# EAGLE design Grove - Haptic Motor v0.9 (EAGLE 7.1.0)
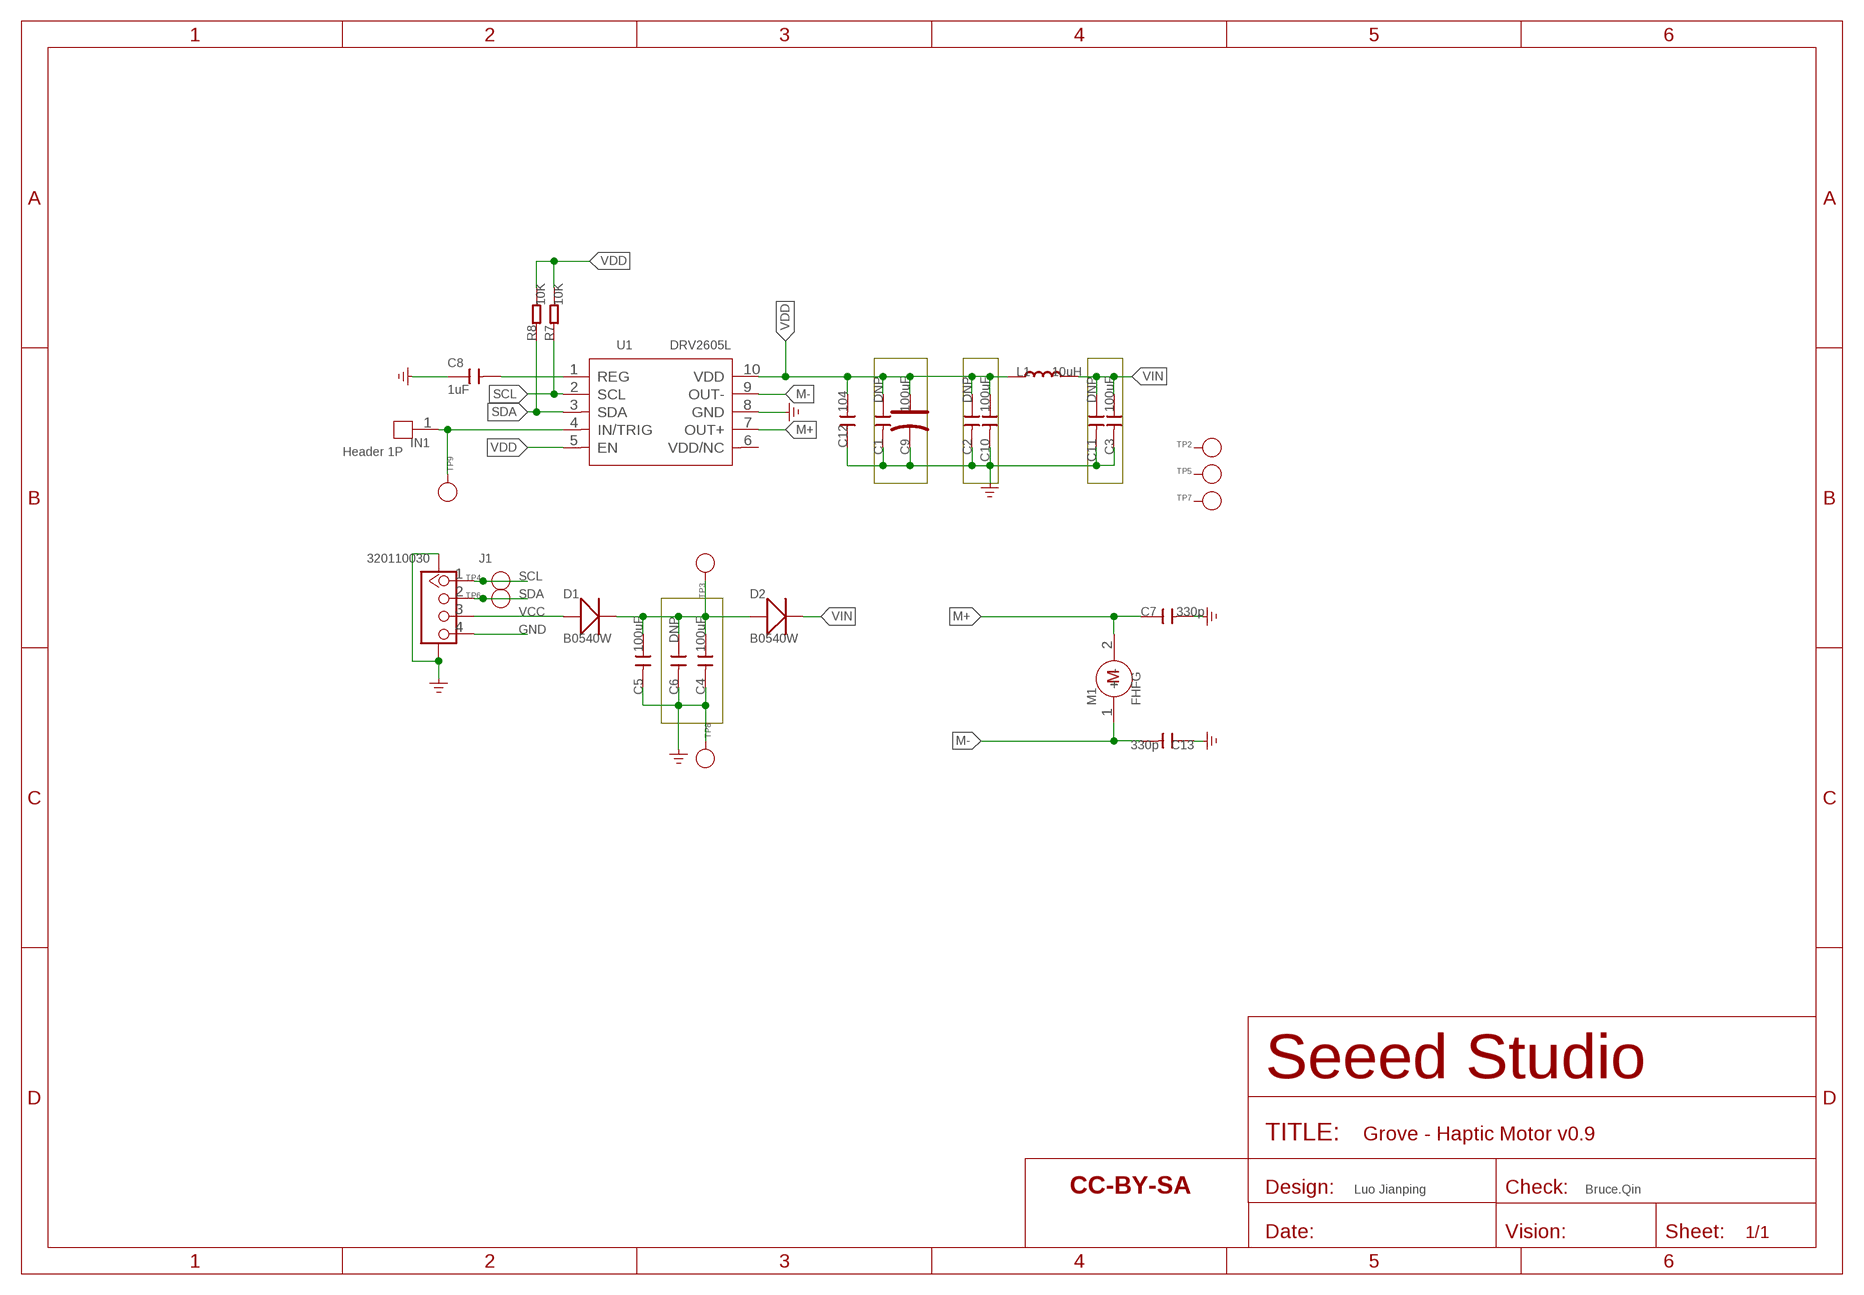
[diagram p0: schematic, sheet 1]

## Parts
C1  DNP  CAP-0805  [C0805]
C2  DNP  CAP-0805  [C0805]
C3  100uF  CAP-1206  [C1206]
C4  100uF  CAP-1206  [C1206]
C5  100uF  CAP-0603  [C0603]
C6  DNP  CAP-0805  [C0805]
C7  330p  CAP-0603  [C0603]
C8  1uF  CAP-0603  [C0603]
C9  100uF  CAP-POLAR-AVX-B  [AVX-B]
C10  100uF  CAP-1206  [C1206]
C11  DNP  CAP-0805  [C0805]
C12  104  CAP-0603  [C0603]
C13  330p  CAP-0603  [C0603]
D1  B0540W  DIODE'1206'  [SOD-123]
D2  B0540W  DIODE'1206'  [SOD-123]
IN1  Header 1P  HEADER-1P-35  [1P-65/35MIL]
J1  320110030  GROVE-CONNECTOR-SMD'DD'  [HW4-SMD-2.0]
L1  10uH  INDUCTOR/FERRITE-BEAD'0806'  [L0806]
M1  FHFG  MOTOR-EXT_MOUDLE_1CM  [MTR2-SMD-D11.2MM]
R7  10K  RES-0603  [R0603]
R8  10K  RES-0603  [R0603]
TP2  PAD-TEST-POINT'4545'  [TP_4545]
TP3  PAD-TEST-POINT'4545'  [TP_4545]
TP4  PAD-TEST-POINT'4545'  [TP_4545]
TP5  PAD-TEST-POINT'4545'  [TP_4545]
TP6  PAD-TEST-POINT'4545'  [TP_4545]
TP7  PAD-TEST-POINT'4545'  [TP_4545]
TP8  PAD-TEST-POINT'4545'  [TP_4545]
TP9  PAD-TEST-POINT'4545'  [TP_4545]
U1  DRV2605L  SENSOR-DRV2605L  [VSSOP10-0.5-3X3MM]
U$9  SEEEDSTUDIO-OPEN-SCH-FRAME  [SEEEDSTUDIO-PCB-FRAME]

## Nets
GND: C1.2 C2.2 C3.2 C4.2 C5.2 C6.2 C7.2 C8.1 C9.- C10.2 C11.2 C12.1 C13.1 J1.4 J1.SS1 J1.SS2 TP8.T U1.8(GND) ; supply symbol labelled GND_POWER
IN/TRIG2: IN1.1 TP9.T U1.4(IN/TRIG)
M+: C7.1 M1.2(-) U1.7(OUT+)
M-: C13.2 M1.1(+) U1.9(OUT-)
REG: C8.2 U1.1(REG)
SCL: J1.1 R7.1 TP4.T U1.2(SCL)
SDA: J1.2 R8.1 TP6.T U1.3(SDA)
VCC: D1.+ J1.3
VDD: C1.1 C2.1 C9.+ C10.1 C12.2 L1.1 R7.2 R8.2 U1.5(EN) U1.10(VDD)
VIN: C3.1 C11.1 D2.- L1.2
VIN-1: C4.1 C5.1 C6.1 D1.- D2.+ TP3.T
Unconnected: TP2.T TP5.T TP7.T U1.6(VDD/NC)

## Notes on the sheet
- Luo Jianping | Bruce.Qin

## Library data of the parts
C1-C8 C10-C13 = Discrete-new:CAP: Ceramic Capacitors
C9 = Discrete-new:CAP-POLAR: Electrolytic Capacitors,Tantalum Capacitors and Super Capacitors
D1 D2 = Discrete-new:DIODE*
IN1 = Connector-new:HEADER-1P
J1 = Connector-new:GROVE-CONNECTOR-SMD: 4P-SMD-2.0:320110030;4P-SMD-2.0-90D:320110032
L1 = Discrete-new:INDUCTOR/FERRITE-BEAD
M1 = Discrete-new:MOTOR-EXT_MOUDLE_1CM
R7 R8 = Discrete-new:RES
TP2-TP9 = Discrete:PAD-TEST-POINT; PARTNO: DNP
U1 = template:SENSOR-DRV2605L
U$9 = moudle-new:SEEEDSTUDIO-OPEN-SCH-FRAME

## Board
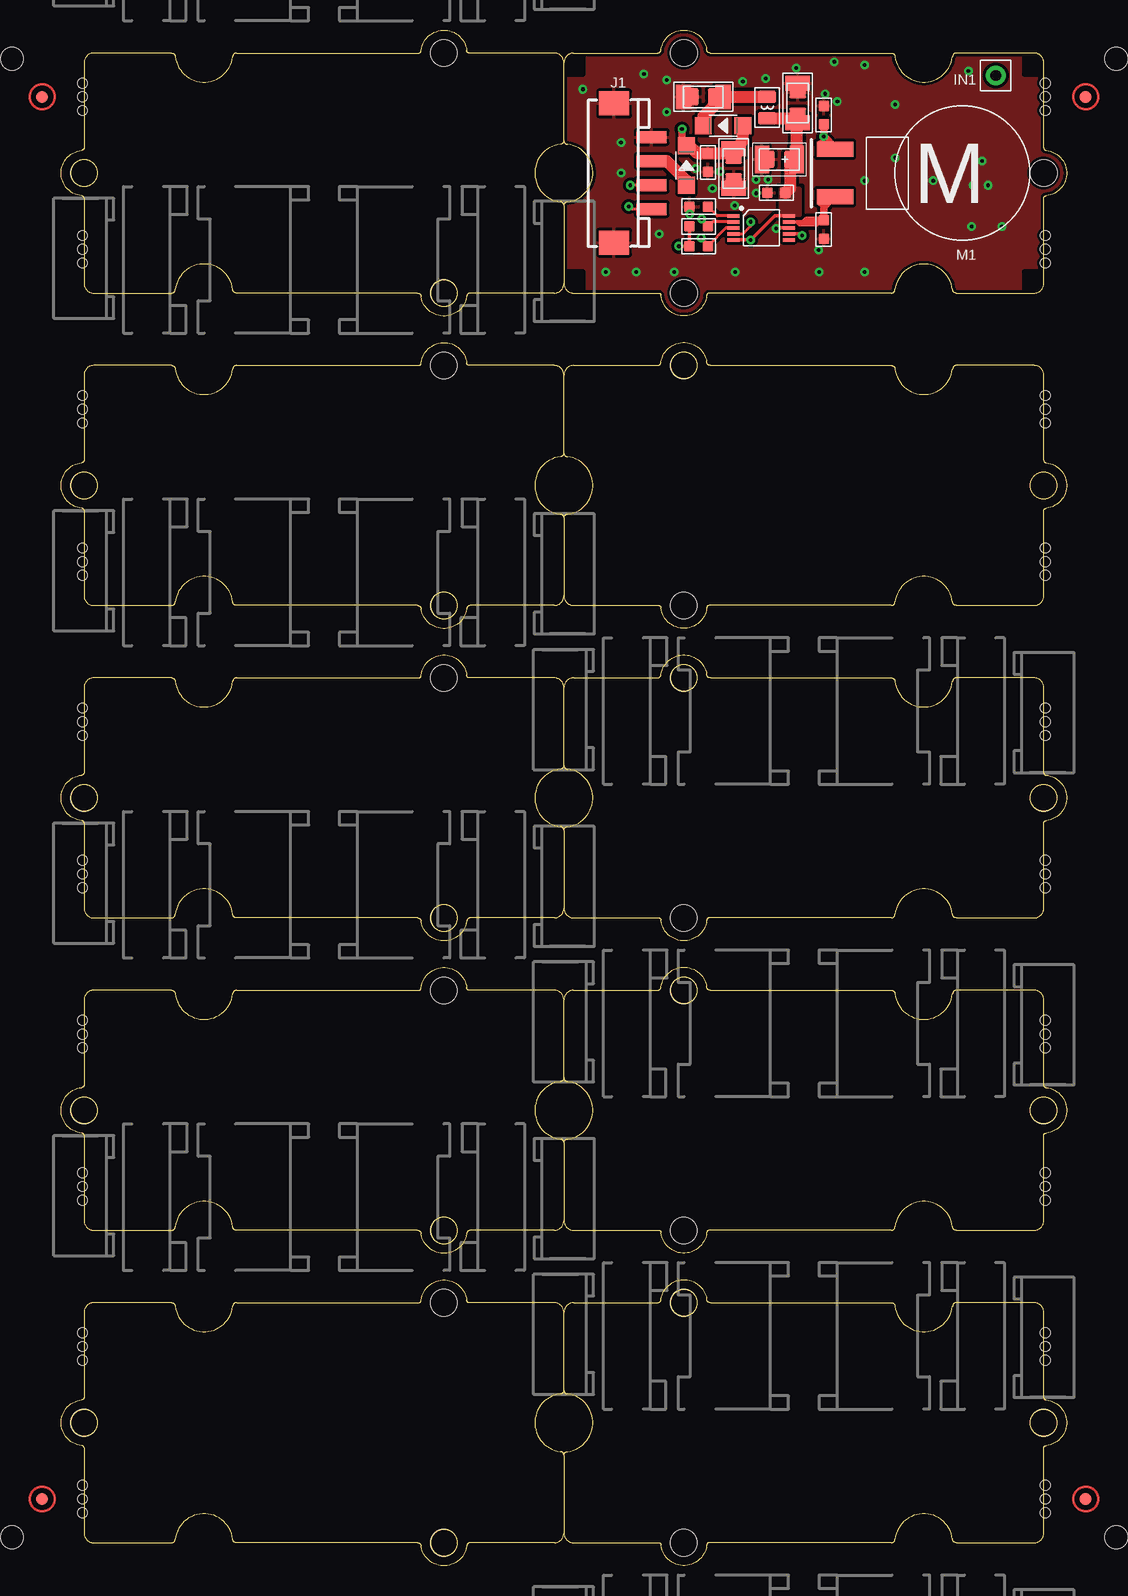
[diagram p1: board, top side]
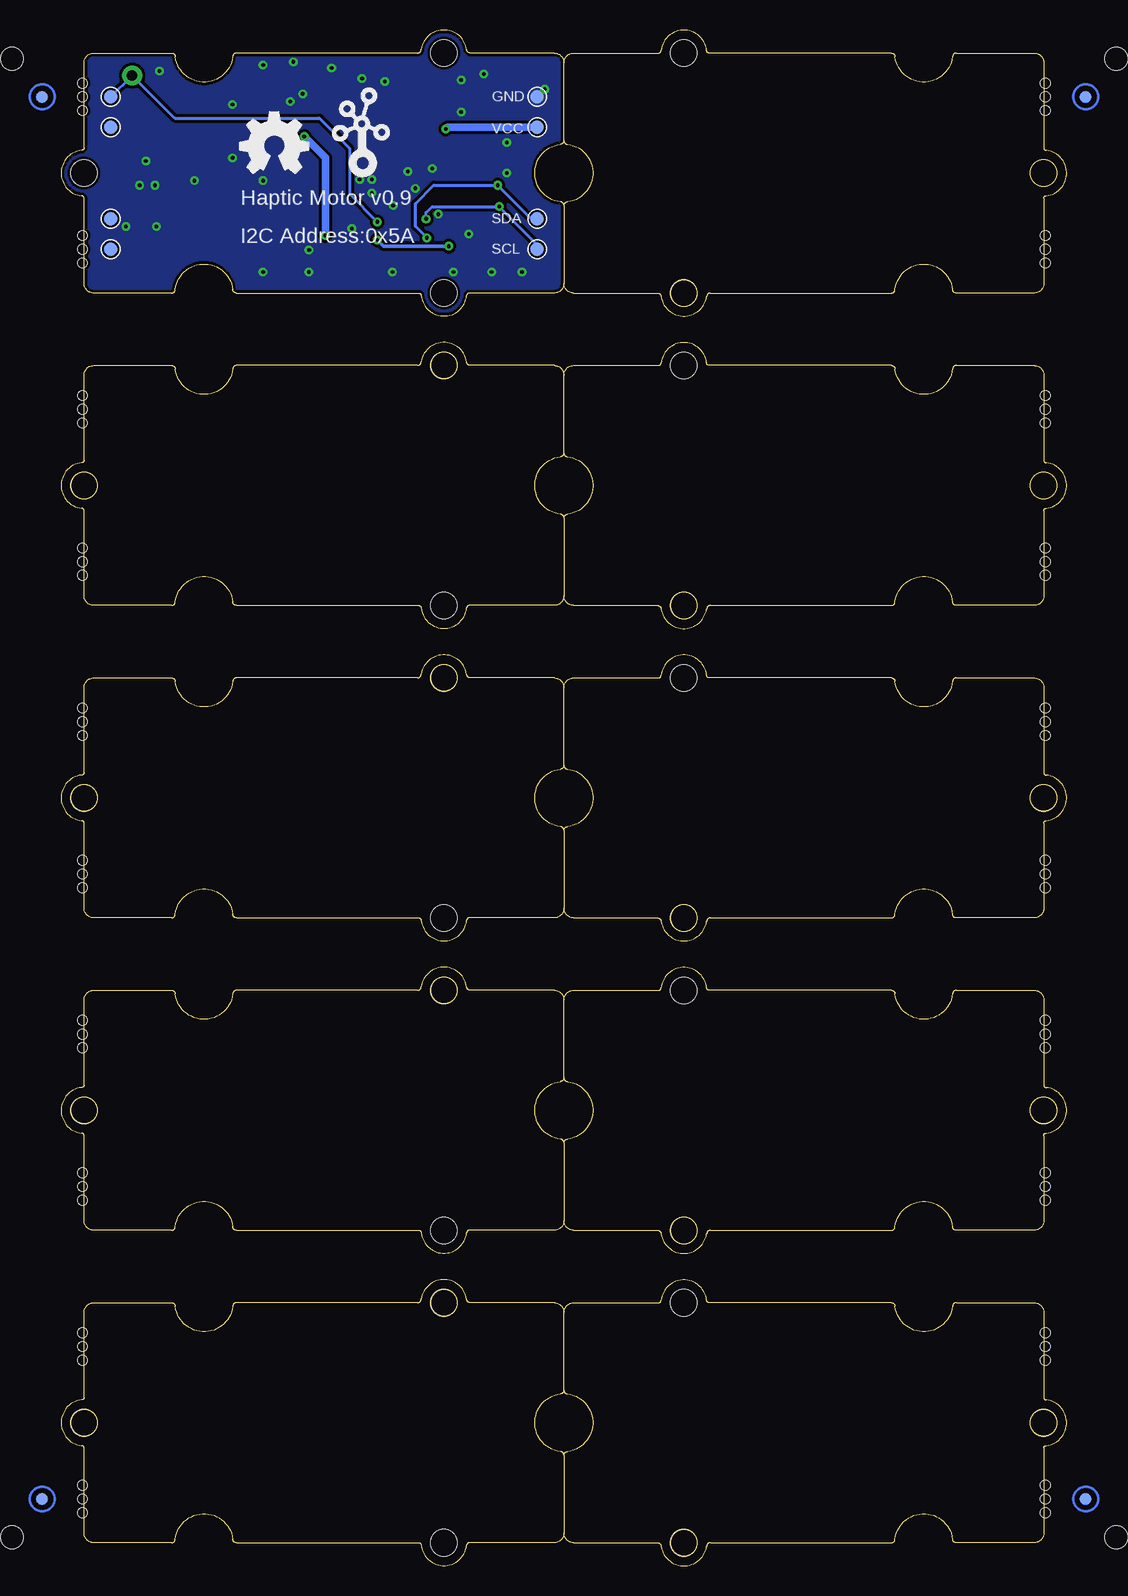
[diagram p2: board, bottom side, seen from below]

Size 41.91 x 23.83 mm. Coordinates in mm from the lower left corner, seen from the top.
Outline: 0.8,21.91 arc90 0,21.11 0,14.61 arc90 0.3,14.31 arc-166 0.3,9.51 arc90 0,9.21 0,2.71 arc90 0.8,1.91 7.9,1.91 arc-90 8.1,1.71 arc168 11.9,1.71 arc-90 12.1,1.91 27.3,1.91 arc90 27.6,2.21 arc-166 32.4,2.21 arc90 32.7,1.91 39.2,1.91 arc90 40,2.71 40,9.81 arc-90 40.2,10.01 arc168 40.2,13.81 arc-90 40,14.01 40,21.11 arc90 39.2,21.91 32.7,21.91 arc90 32.4,21.61 arc-166 27.6,21.61 arc90 27.3,21.91 12.2,21.91 arc-90 11.9,22.21 arc162 8.1,22.21 arc-90 7.8,21.91 0.8,21.91
Copper layers (1*16): Top 0.035mm / dielectric 1.5mm / Bottom 0.035mm
Design rules "default *": minimum track width 8mil, minimum drill 12mil, track to track 8mil, track to pad 6mil, pad to pad 7.5mil, via to via 6mil, smd to smd 0mil, copper to edge 10mil, drill to drill 8mil, minimum pad ring 10mil, minimum via ring 8mil, stop-mask expansion 4mil, vias tented up to drill 13mil, thermal gap 10mil
Holes 0.8 mm at -40.13,19.4 -40.13,17.12 -40.13,18.26 -40.13,6.7 -40.13,4.42 -40.13,5.56 -40.13,-6.63 -40.13,-8.92 -40.13,-7.78 -40.13,-19.33 -40.13,-21.62 -40.13,-20.48 -40.13,-32.67 -40.13,-34.95 -40.13,-33.81 -40.13,-45.37 -40.13,-47.65 -40.13,-46.51 -40.13,-58.7 -40.13,-60.99 -40.13,-59.85 -40.13,-71.4 -40.13,-73.69 -40.13,-72.55 -40.13,-84.74 -40.13,-87.02 -40.13,-85.88 -40.13,-97.44 -40.13,-99.72 -40.13,-98.58 40.13,17.12 40.13,19.4 40.13,18.26 40.13,4.42 40.13,6.7 40.13,5.56 40.13,-8.92 40.13,-6.63 40.13,-7.78 40.13,-21.62 40.13,-19.33 40.13,-20.48 40.13,-34.95 40.13,-32.67 40.13,-33.81 40.13,-47.65 40.13,-45.37 40.13,-46.51 40.13,-60.99 40.13,-58.7 40.13,-59.85 40.13,-73.69 40.13,-71.4 40.13,-72.55 40.13,-87.02 40.13,-84.74 40.13,-85.88 40.13,-99.72 40.13,-97.44 40.13,-98.58
Holes 1.91 mm at -46.04,-101.76 46.03,-101.76 46.03,21.43 -46.04,21.43

### Footprints (pad centres in the part's own frame; a part is rotated, then mirrored left to right if it is on the bottom)
C0805 = smd 1.397 x 1.016: 1 0,0.889; 2 0,-0.889
C1206 = smd 1.27 x 2.032: 1 -1.651,0; 2 1.651,0
C0603 = smd 0.889 x 0.889: 1 0,0.762; 2 0,-0.762
AVX-B = smd 1.143 x 2.286: + -1.46,0; - 1.46,0
SOD-123 = smd 1.397 x 1.397: + -1.651,0; - 1.651,0
1P-65/35MIL = drill 0.889 pad 1.651: 1 0,0
HW4-SMD-2.0 = smd 1 x 2.5: 1 -3,0; 2 -1,0; 3 1,0; 4 3,0 | smd 2 x 2.5: SS1 -5.8,3.123; SS2 5.8,3.123
L0806 = smd 1.016 x 1.524: 1 -0.889,0; 2 0.889,0
MTR2-SMD-D11.2MM = smd 3.048 x 1.27: 1 10.613,1.976; 2 10.613,-1.976
ROUND-MARK-1.0 = smd 1.016 x 1.016: P$1 0,0
R0603 = smd 0.889 x 0.889: 1 0,0.762; 2 0,-0.762
TP_4545 = smd 1.143 x 1.143: T 0,0
VSSOP10-0.5-3X3MM = smd 0.3 x 1: 1 -1,-2.3; 2 -0.5,-2.3; 3 0,-2.3; 4 0.5,-2.3; 5 1,-2.3; 6 1,2.3; 7 0.5,2.3; 8 0,2.3; 9 -0.5,2.3; 10 -1,2.3
GROVE-TEST-PLATFORM = hole 2.2: -10,-10; -10,10; 20,0
GROVE-1*2-DRILL-SILK = hole 2.21: -20,0; 10,10; 10,-10

### Placement (x,y rotation side)
C1  17.97,13.05 270 top
C2  19.49,17.75 180 top
C3  11.62,18.26 180 top
C4  14.16,12.29 270 top
C5  12,12.8 0 top
C6  14.16,12.29 0 top
C7  21.65,16.73 180 top
C8  11.24,9.11 90 top
C9  17.97,13.05 180 top
C10  19.49,17.75 90 top
C11  11.62,18.26 270 top
C12  17.71,10.26 90 top
C13  21.65,7.21 180 top
D1  10.22,12.54 90 top
D2  13.27,15.85 180 top
IN1  36,20.04 0 top
J1  7.3,11.91 90 top
L1  16.95,17.37 90 top
M1  33.21,11.91 180 top
P1  [ROUND-MARK-1.0]  -43.5,-98.58 0 top  (outside the outline)
P2  [ROUND-MARK-1.0]  43.5,-98.58 0 top  (outside the outline)
P3  [ROUND-MARK-1.0]  -43.5,18.26 0 top  (outside the outline)
P4  [ROUND-MARK-1.0]  43.5,18.26 0 top
P5  [ROUND-MARK-1.0]  -43.5,-98.58 0 bottom  (outside the outline)
P6  [ROUND-MARK-1.0]  43.5,-98.58 0 bottom  (outside the outline)
P7  [ROUND-MARK-1.0]  43.5,18.26 0 bottom
P8  [ROUND-MARK-1.0]  -43.5,18.26 0 bottom  (outside the outline)
R7  11.24,7.46 270 top
R8  11.24,5.81 270 top
TP2  37.78,15.72 0 bottom
TP3  2.22,15.72 0 bottom
TP4  2.22,5.56 0 bottom
TP5  37.78,8.1 0 bottom
TP6  2.22,8.1 0 bottom
TP7  37.78,5.56 0 bottom
TP8  2.22,18.26 0 bottom
TP9  37.78,18.26 0 bottom
U1  16.44,7.34 270 top
U2  [GROVE-TEST-PLATFORM]  20,-66.2 0 top  (outside the outline)
U3  [GROVE-TEST-PLATFORM]  -20.01,-66.2 180 top  (outside the outline)
U4  [GROVE-TEST-PLATFORM]  20,-40.16 0 top  (outside the outline)
U5  [GROVE-TEST-PLATFORM]  -20.01,-40.16 180 top  (outside the outline)
U6  [GROVE-TEST-PLATFORM]  20,-14.13 0 top  (outside the outline)
U7  [GROVE-TEST-PLATFORM]  -20.01,-14.13 180 top  (outside the outline)
U8  [GROVE-TEST-PLATFORM]  -20.01,11.91 180 top  (outside the outline)
U10  [GROVE-TEST-PLATFORM]  20,-92.23 0 top  (outside the outline)
U11  [GROVE-TEST-PLATFORM]  -20.01,-92.23 180 top  (outside the outline)
U$5  [GROVE-1*2-DRILL-SILK]  20,11.91 180 top
U$6  [OSHW_FILLX200_NOTEXT]  26.98,11.91 0 bottom
U$7  [TWIGLOGO]  16.82,12.54 0 bottom
U$9  -63.82,30.96 0 top  (outside the outline)

### Tracks (layer width: path | path; a pad name or v marks a point on that pad's centre or on a via)
GND  (via drill 0.3 pad 0.61)
  Top 0.279: U1.8 17.74,7.34 v17.69,7.29
  other vias: 27.62,13.18 22.54,21.18 25.08,3.65 21.27,3.65 14.29,3.65 3.49,3.65 7.94,6.83 9.21,3.65 4.76,11.91 4.76,14.45 1.59,18.89 6.66,20.16 8.57,16.99 16.82,19.78 22.79,17.88 21.78,18.51 19.36,20.67 30.8,11.27 25.08,20.93 34.1,10.89 14.92,19.53 34.86,12.92 33.97,7.46 36.51,7.46 35.37,10.89 10.98,12.29 6.03,3.65 13.02,12.04 10.47,8.48 33.72,20.42 12.38,10.64 16.01,10.23 16.01,11.37 17.03,11.37 14.23,9.22 21.24,5.51 25.08,11.27 8.57,19.66 27.62,17.62
  pour Top (isolate 0.254, rank 3): -0.7,23.59 7.55,23.59 8.13,24.16 38.29,24.1 41.84,20.54 41.84,3.15 38.8,0.1 0.44,0.1 -1.72,2.26 -1.72,22.58
  pour Bottom (isolate 0.254, rank 3): -0.7,23.59 7.55,23.59 8.06,24.1 38.29,24.1 41.84,20.54 41.84,3.15 38.8,0.1 0.44,0.1 -1.72,2.26 -1.72,22.58
IN/TRIG2  (via drill 0.3 pad 0.61)
  Top 0.254: U1.4 14.93,6.84 15.55,7.46 v15.55,7.84
  Bottom 0.254: TP9.T IN1.1 32.45,16.48 20.38,16.48 17.84,13.94 17.84,10.13 v15.55,7.84
M+  (via drill 0.3 pad 0.61)
  Top 0.305: U1.7 19.74,6.84 v19.87,6.7
  Top 0.61: C7.1 v21.65,14.96 | v21.65,14.96 21.65,14.83 | M1.2 22.59,14.01 v21.65,14.96 | v21.65,14.96 21.65,13.94 | v21.65,14.96 21.65,14.58 21.4,14.32
  Bottom 0.61: v19.87,6.7 19.87,13.18 v21.65,14.96
M-
  Top 0.254: U1.9 19.37,7.84
  Top 0.305: 19.86,7.84 20.12,7.84 20.19,7.91 | 21.52,7.97 21.14,7.59 19.62,7.59 19.37,7.84 19.86,7.84 | 19.86,7.84 20.13,8.1 20.51,8.1
  Top 0.61: 20.13,7.84 20.19,7.91 20.25,7.97 21.52,7.97 C13.2 21.65,8.99 21.65,9.11 | 21.65,9.24 21.65,9.37 22.16,9.88 22.54,9.88 M1.1 | 21.65,9.11 21.65,9.24 | 21.65,9.24 21.4,9.5 | 21.65,9.11 22.16,9.62
REG
  Top 0.254: U1.1 12.78,8.34 C8.2
SCL  (via drill 0.3 pad 0.61)
  Top 0.254: v11.49,8.1 12.01,7.34 R7.1 12.37,7.84 U1.2 | J1.1 5.6,8.91 v5.39,9.11
  Bottom 0.254: TP4.T 2.35,5.56 2.35,6.07 v5.39,9.11 10.98,9.11 11.49,8.61 v11.49,8.1
SDA  (via drill 0.3 pad 0.61)
  Top 0.254: 12,5.69 R8.1 13.52,7.34 U1.3 | J1.2 5.54,10.91 v5.52,10.89
  Top 0.305: 12,5.69 12,5.94 v11.43,6.51
  Bottom 0.254: TP6.T 2.73,8.1 v5.52,10.89 10.86,10.89 12.38,9.37 12.38,7.46 v11.43,6.51
VCC
  Top 1.016: J1.3 8.59,12.91 10.22,11.27 D1.+
VDD  (via drill 0.3 pad 0.64)
  Top 0.305: U1.5 15.54,6.34 v15.55,6.32 17.57,8.34 U1.10 | R7.2 10.6,7.46 10.47,7.34 R8.2 v9.59,5.81
  Top 1.016: C12.2 18.86,10.64 C1.1 C9.+ 19.43,16.61 | 19.43,16.61 19.43,16.8 C2.1 | L1.1 19.3,16.48 19.33,16.51 | 19.33,16.51 19.43,16.61 | C10.1 19.49,16.35 19.33,16.51
  Bottom 0.305: v9.59,5.81 15.05,5.81 v15.55,6.32
  pour Top (isolate 0.254, no thermals): 18.73,8.23 18.09,8.23 17.97,8.35 17.97,10.64 18.09,10.77 19.62,10.77 19.75,10.64 19.75,8.35 19.62,8.23
VIN
  Top 1.016: D2.- 11.62,16.61 C3.1 | C11.1 C3.1 | C3.1 L1.2
VIN-1  (via drill 0.3 pad 0.61)
  Top 0.61: v9.84,15.59 9.84,14.58 D1.-
  Top 1.016: D1.- 10.47,14.19 11.11,13.56 C5.1 13.78,13.56 | 13.78,13.56 C6.1 | 13.78,13.56 C4.1 14.29,13.94 14.92,14.58 D2.+
  Bottom 0.61: TP3.T 9.71,15.72 v9.84,15.59

### Text on the board
tPlace: J1 | IN1 | M1
bPlace: GND | VCC | Haptic Motor v0.9 | SDA | I2C Address:0x5A | SCL